# Altium project frm-mw-diode-detector.PrjPCB
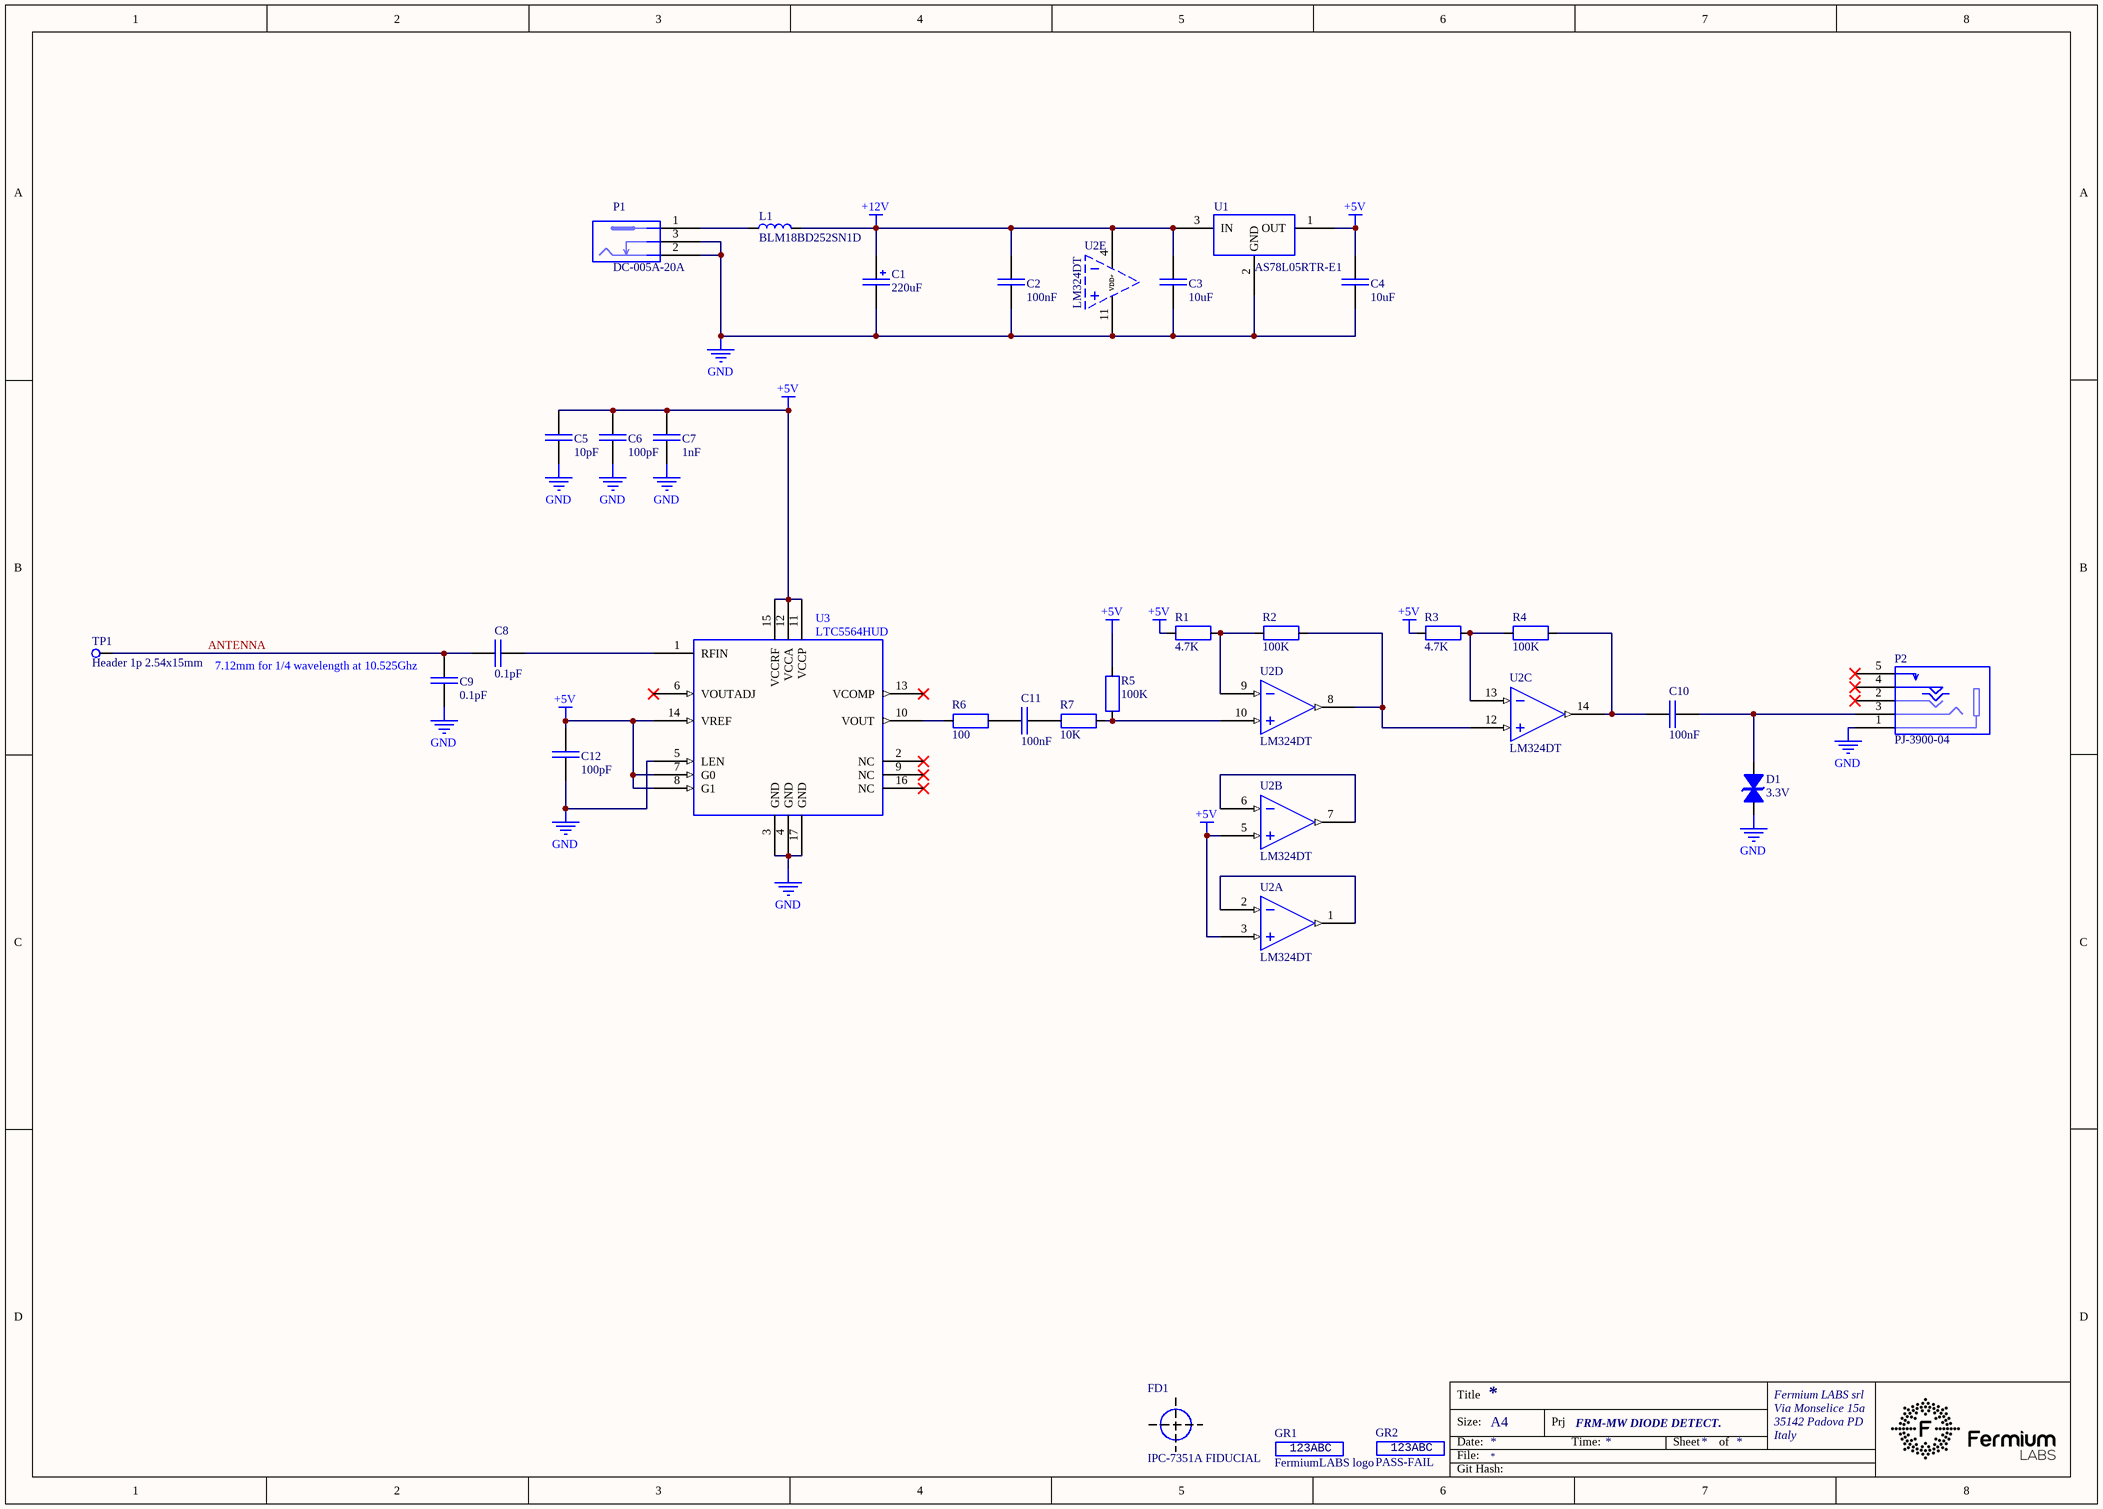
[diagram p0: frm-mw-diode-detector.SchDoc]
ProjectTitle: FRM-MW DIODE DETECT.
1 sheet, 30 parts. Net scope: global (net labels, ports and power ports of the same name join across sheets).
Board file: frm-mw-diode-detector.PcbDoc

## Sheet frm-mw-diode-detector.SchDoc
size A3

### Parts
C1  220uF  [3924B366-8672-45E9-B0BE-62DACC24E783]
C2  100nF  [CAP 0603_1608]
C3  10uF  [CAP 0805_2012]
C4  10uF  [CAP 0805_2012]
C5  10pF  [CAP 0603_1608]
C6  100pF  [CAP 0603_1608]
C7  1nF  [CAP 0603_1608]
C8  0.1pF  [CAP 0402_1005 RF]
C9  0.1pF  [CAP 0402_1005 RF]
C10  100nF  [CAP 0603_1608]
C11  100nF  [CAP 0603_1608]
C12  100pF  [CAP 0603_1608]
D1  3.3V  [SOD523F]
FD1  IPC-7351A FIDUCIAL  [FIDUCIAL-IPC-7351A]  (no BOM)
GR1  FermiumLABS logo  [5394DE47-A0E8-4329-8464-7791B7C19310]  (no BOM)
GR2  PASS-FAIL  [0B1556B7-A534-4801-B57D-01EFA34B1205]  (no BOM)
L1  BLM18BD252SN1D  [FER 0603_1608]
P1  DC-005A-20A  [F0972D8A-C5C0-4A84-836D-A9666EE65C2D]
P2  PJ-3900-04  [7EF2B92C-0FC9-4C85-B662-5CEC65BFCCC4]
R1  4.7K
R2  100K  [RES 0603_1608]
R3  4.7K
R4  100K  [RES 0603_1608]
R5  100K  [RES 0603_1608]
R6  100
R7  10K  [RES 0603_1608]
TP1  Header 1p 2.54x15mm  [2C1CB748-2B7B-4AED-959C-BA5F218FC650]  (no BOM)
U1  AS78L05RTR-E1  [E733EFB9-FE91-4AE9-9197-29251971C3DC]
U2  LM324DT  [34355DA5-B1DA-47C2-A88A-ECF82120A4F7]  (parts A,B,C,D,E of 5)
U3  LTC5564HUD  [1C9CA8C2-7F7E-4E2B-A488-6DD37E6BADEA]

### Nets
+5V: C4.2 C5.1 C6.1 C7.1 C12.1 R1.1 R3.2 R5.2 U1.1(OUT) U2.3(IN+) U2.5(IN+) U3.7(G0) U3.8(G1) U3.11(VCCP) U3.12(VCCA) U3.14(VREF) U3.15(VCCRF)
+12V: C1.1 C2.2 C3.2 L1.2 U1.3(IN) U2.4(VDD+)
GND: C1.2 C2.1 C3.1 C4.1 C5.2 C6.2 C7.2 C9.1 C12.2 D1.2 P1.2 P1.3 P2.1(GND) U1.2(GND) U2.11(VDD-) U3.3(GND) U3.4(GND) U3.5(LEN) U3.17(GND)
ANTENNA: C8.1 C9.2 TP1.1(TP)
NetC8_2: C8.2 U3.1(RFIN)
NetC10_1: C10.1 R4.2 U2.14(OUT)
NetC10_2: C10.2 D1.1 P2.3(L)
NetC11_1: C11.1 R6.2
NetC11_2: C11.2 R7.2
NetL1_1: L1.1 P1.1
NetR1_2: R1.2 R2.2 U2.9(IN-)
NetR2_1: R2.1 U2.8(OUT) U2.12(IN+)
NetR3_1: R3.1 R4.1 U2.13(IN-)
NetR5_1: R5.1 R7.1 U2.10(IN+)
NetR6_1: R6.1 U3.10(VOUT)
NetU2_1: U2.1(OUT) U2.2(IN-)
NetU2_6: U2.6(IN-) U2.7(OUT)

Not connected (* = marked no-connect by the designer): P2 2(R)* 4(AUX)* 5(AUX)*; U3 2(NC)* 6(VOUTADJ)* 9(NC)* 13(VCOMP)* 16(NC)*

### Notes on the sheet
- (near C9) 7.12mm for 1/4 wavelength at 10.525Ghz
- Title
- Fermium LABS srl
- Size:
- Date:
- File:
- A4
- Prj
- Time:
- Sheet
- of
- Via Monselice 15a
- 35142 Padova PD
- Italy
- Git Hash:
- (in symbol 50f8ea88-0034-49fe-a263-d8e97bc35e2f) 123ABC
- (in symbol d1abe19f-3fed-4f20-b2ed-afc0ffbc6628) 123ABC

### Library data of the parts
C1 = 1a28df19-6d3e-4a71-836c-f22920f8e8ab: CAP  THT ELEC 220uF 25V 20%; Manufacturer 1: Rubycon; Manufacturer Part Number 1: 25PK220MEFC-6.3*11; id: 14782; Part Number: 1a28df19-6d3e-4a71-836c-f22920f8e8ab; ComponentLink1Description: Datasheet; ComponentLink1URL: http://localhost:8080/static/files/Rubycon-220uF-25V_C109337_12019-03-10_214953.757848.pdf?Rubycon-220uF-25V_C109337 (1).pdf; Value: 220uF
C2 C10 C11 = 02841f84-ac15-41b5-9e17-915f8f067828: CAP SMD MLCC 100nF 25V 0603 X7R; Manufacturer 1: Samsung Electro-Mechanics; Manufacturer Part Number 1: CL10B104KA8NNNC; id: 14784; Part Number: 02841f84-ac15-41b5-9e17-915f8f067828; ComponentLink1Description: Datasheet; ComponentLink1URL: http://localhost:8080/static/files/Samsung-Electro-Mechanics-CL10B104KA8NNNC_C15902019-03-10_215548.826887.pdf?Samsung-Electro-Mechanics-CL10B104KA8NNNC_C1590.pdf; Value: 100nF
C3 C4 = 1ffbe5a9-0884-4740-bdad-20a6a98400e6: CAP SMD MLCC 10uF 25V 0805 X5R; Manufacturer 1: Samsung Electro-Mechanics; Manufacturer Part Number 1: CL21A106KAYNNNE; id: 14779; Part Number: 1ffbe5a9-0884-4740-bdad-20a6a98400e6; ComponentLink1Description: Datasheet; ComponentLink1URL: http://localhost:8080/static/files/Samsung-Electro-Mechanics-CL21A106KAYNNNE_C158502019-03-10_213827.610739.pdf?Samsung-Electro-Mechanics-CL21A106KAYNNNE_C15850.pdf; Value: 10uF; Manufacturer 2: Murata; Manufacturer Part Number 2: GRM21BR61E106KA73L
C5 = b659b677-71ac-4e84-9ac8-47a475f18d31: CAP SMD MLCC 10pF 50V 0603 C0G/NP0; Manufacturer 1: Yageo; Manufacturer Part Number 1: CC0603GRNPO9BN100; id: 14805; Part Number: b659b677-71ac-4e84-9ac8-47a475f18d31; Value: 10pF
C6 C12 = ccf679fd-1b09-4431-be81-04c3ce295510: CAP SMD MLCC 100pF 100V 0603 C0G/NP0; Manufacturer 1: Yageo; Manufacturer Part Number 1: CC0603JRNPO0BN101; id: 14804; Part Number: ccf679fd-1b09-4431-be81-04c3ce295510; Value: 100pF
C7 = 0eca2548-3630-4fea-a3d5-94248c1cae74: CAP SMD MLCC 1nF 50V 0603 X7R; Manufacturer 1: Samsung Electro-Mechanics; Manufacturer Part Number 1: CL10B102KB8NNNC; id: 14785; Part Number: 0eca2548-3630-4fea-a3d5-94248c1cae74; ComponentLink1Description: Datasheet; ComponentLink1URL: http://localhost:8080/static/files/Samsung-Electro-Mechanics-CL10B102KB8NNNC_C1588_12019-03-10_215732.131818.pdf?Samsung-Electro-Mechanics-CL10B102KB8NNNC_C1588 (1).pdf; Value: 1nF
C8 C9 = 26a1b8a5-3146-4e38-b8a1-20cf4d8b229c: CAP SMD MLCC 0.1pF 50V 0402 HIGH-Q; Manufacturer 1: Murata; Manufacturer Part Number 1: GJM1555C1HR10BB01D; id: 14808; Part Number: 26a1b8a5-3146-4e38-b8a1-20cf4d8b229c; Value: 0.1pF
D1 = d6266fd0-7428-4fb9-a062-338cdce926fd: DIODE SMD TVS 3.3V BIDIRECTIONAL SOD-523; Manufacturer 1: Born Semiconductor; Manufacturer Part Number 1: PESD3V3S1BA-N; id: 14798; Part Number: d6266fd0-7428-4fb9-a062-338cdce926fd; ComponentLink1Description: Datasheet; ComponentLink1URL: http://localhost:8080/static/files/Bourne-Semicon-Shenzhen-PESD3V3S1BA-N_C3160372019-04-07_002431.794112.pdf?Bourne-Semicon-Shenzhen-PESD3V3S1BA-N_C316037.pdf; Value: 3.3V
FD1 = 19da4612-eb95-43bb-9984-553a52b2a224: GRAPHICS FIDUCIAL IPC-7351A; id: 14800; Part Number: 19da4612-eb95-43bb-9984-553a52b2a224
GR1 = 50f8ea88-0034-49fe-a263-d8e97bc35e2f: GRAPHICS LOGO FERMIUM LABS SRL; id: 14799; Part Number: 50f8ea88-0034-49fe-a263-d8e97bc35e2f
GR2 = d1abe19f-3fed-4f20-b2ed-afc0ffbc6628: GRAPHICS PASS-FAIL MARK; id: 14801; Part Number: d1abe19f-3fed-4f20-b2ed-afc0ffbc6628
L1 = c9e30ae8-9d5b-4135-a079-b1147da846d8: FER SMD CHIP 0603 400mA 1k@100MHz 500mOhm; Manufacturer 1: Murata; id: 14786; Part Number: c9e30ae8-9d5b-4135-a079-b1147da846d8; ComponentLink1Description: Datasheet; ComponentLink1URL: http://localhost:8080/static/files/Murata-Electronics-BLM18AG102SN1D_C858242019-03-10_220021.186607.pdf?Murata-Electronics-BLM18AG102SN1D_C85824.pdf; Manufacturer Part Number 1: BLM18BD252SN1D
P1 = b53db51a-1725-412b-9039-fa7a45c7c438: CONN THT DC JACK 0.5A 30VDC 5Kcycles; Manufacturer 1: HRO Electronics; id: 14780; Part Number: b53db51a-1725-412b-9039-fa7a45c7c438; ComponentLink1Description: Datasheet; ComponentLink1URL: http://localhost:8080/static/files/Korean-Hroparts-Elec-DC-005A-20A_C191049_22019-03-10_214231.486078.pdf?Korean-Hroparts-Elec-DC-005A-20A_C191049 (2).pdf; Manufacturer Part Number 1: DC-005A-20A
P2 = 80507a24-5d7c-4cf5-953e-f54832d54564: CONN THT 3.5mm AUDIO STEREO AUX SWITCH; Manufacturer 1: HRO Electronics; id: 14793; Part Number: 80507a24-5d7c-4cf5-953e-f54832d54564; ComponentLink1Description: Datasheet; ComponentLink1URL: http://localhost:8080/static/files/Korean-Hroparts-Elec-PJ-3900-04_C1518392019-04-10_231144.687617.pdf?Korean-Hroparts-Elec-PJ-3900-04_C151839.pdf; Manufacturer Part Number 1: PJ-3900-04
R1 R3 = 86e7c7d8-c04a-4e9a-bdc1-b1b3729c93a3: RES SMD 4.7K OHM 1% 1/10W 0603; Manufacturer 1: Yageo; Manufacturer Part Number 1: RC0603FR-074K7L; id: 12445; Part Number: 86e7c7d8-c04a-4e9a-bdc1-b1b3729c93a3; Value: 4.7K
R2 R4 R5 = 76af10b3-9d85-4b5c-a2d6-26cc74f432f7: RES SMD 100K OHM 1% 1/10W 0603; Manufacturer 1: Yageo; Manufacturer Part Number 1: RC0603FR-07100KL; id: 12746; Part Number: 76af10b3-9d85-4b5c-a2d6-26cc74f432f7; Value: 100K
R6 = 0a6c4b74-f837-4563-b154-6e196d753525: RES SMD 100 OHM 1% 1/10W 0603; Manufacturer 1: Yageo; Manufacturer Part Number 1: RC0603FR-07100RL; id: 12301; Part Number: 0a6c4b74-f837-4563-b154-6e196d753525; Value: 100
R7 = 93242766-ba1d-462d-b58f-ce1dfc4129c8: RES SMD 10K OHM 1% 1/10W 0603; Manufacturer 1: Yageo; Manufacturer Part Number 1: RC0603FR-0710KL; id: 12101; Part Number: 93242766-ba1d-462d-b58f-ce1dfc4129c8; Value: 10K
TP1 = 6533a5d9-7dc1-4b74-ad41-7af9be51a6b8: CONN THT PIN HEADER 1P MALE 2.54mm 15mm HEIGHT; Manufacturer 1: Boom Precision Elec; Manufacturer Part Number 1: ---; id: 14825; Part Number: 6533a5d9-7dc1-4b74-ad41-7af9be51a6b8
U1 = fd64863e-487f-4688-b264-696c0ba5456b: IC SMD LINEAR VOLTAGE REGULATOR 5V 100mA SOT-89; Manufacturer 1: Diodes Inc.; id: 14783; Part Number: fd64863e-487f-4688-b264-696c0ba5456b; ComponentLink1Description: Datasheet; ComponentLink1URL: http://localhost:8080/static/files/Diodes-Incorporated-AS78L05RTR-E1_C90471_12019-03-10_215252.941962.pdf?Diodes-Incorporated-AS78L05RTR-E1_C90471 (1).pdf; ComponentLink2Description: Datasheet; ComponentLink2URL: http://localhost:8080/static/files/KIA-Semicon-Tech-KIA78L05T_C90763_12019-03-10_215415.523371.pdf?KIA-Semicon-Tech-KIA78L05T_C90763 (1).pdf; Manufacturer 2: KIA Semicon Tech; Manufacturer Part Number 1: AS78L05RTR-E1; Manufacturer Part Number 2: KIA78L05T
U2 = 21a85167-c328-42f7-a52e-365842c6dad3: IC SMD OPAMP LM324DT SO-14; Manufacturer 1: ST Microelectronics; id: 14792; Part Number: 21a85167-c328-42f7-a52e-365842c6dad3; ComponentLink1Description: Datasheet; ComponentLink1URL: http://localhost:8080/static/files/STMicroelectronics-LM324DT_C710352019-04-06_191500.254110.pdf?STMicroelectronics-LM324DT_C71035.pdf; Manufacturer Part Number 1: LM324DT
U3 = 45536c7f-5716-49d5-adce-f87923efcc45: IC SMD RF POWER DETECTOR 15GHz LTC5564 QFN-16; Manufacturer 1: Analog Devices / Linear Technology; id: 14803; Part Number: 45536c7f-5716-49d5-adce-f87923efcc45; ComponentLink1Description: Datasheet; ComponentLink1URL: http://localhost:8080/static/files/5564fc2019-04-28_163050.562654.pdf?5564fc.pdf; Manufacturer 2: Analog Devices / Linear Technology; Manufacturer Part Number 1: LTC5564HUD; Manufacturer Part Number 2: LTC5564IUD